# EAGLE design SolarSimulatorPanel (EAGLE 9.3.0)
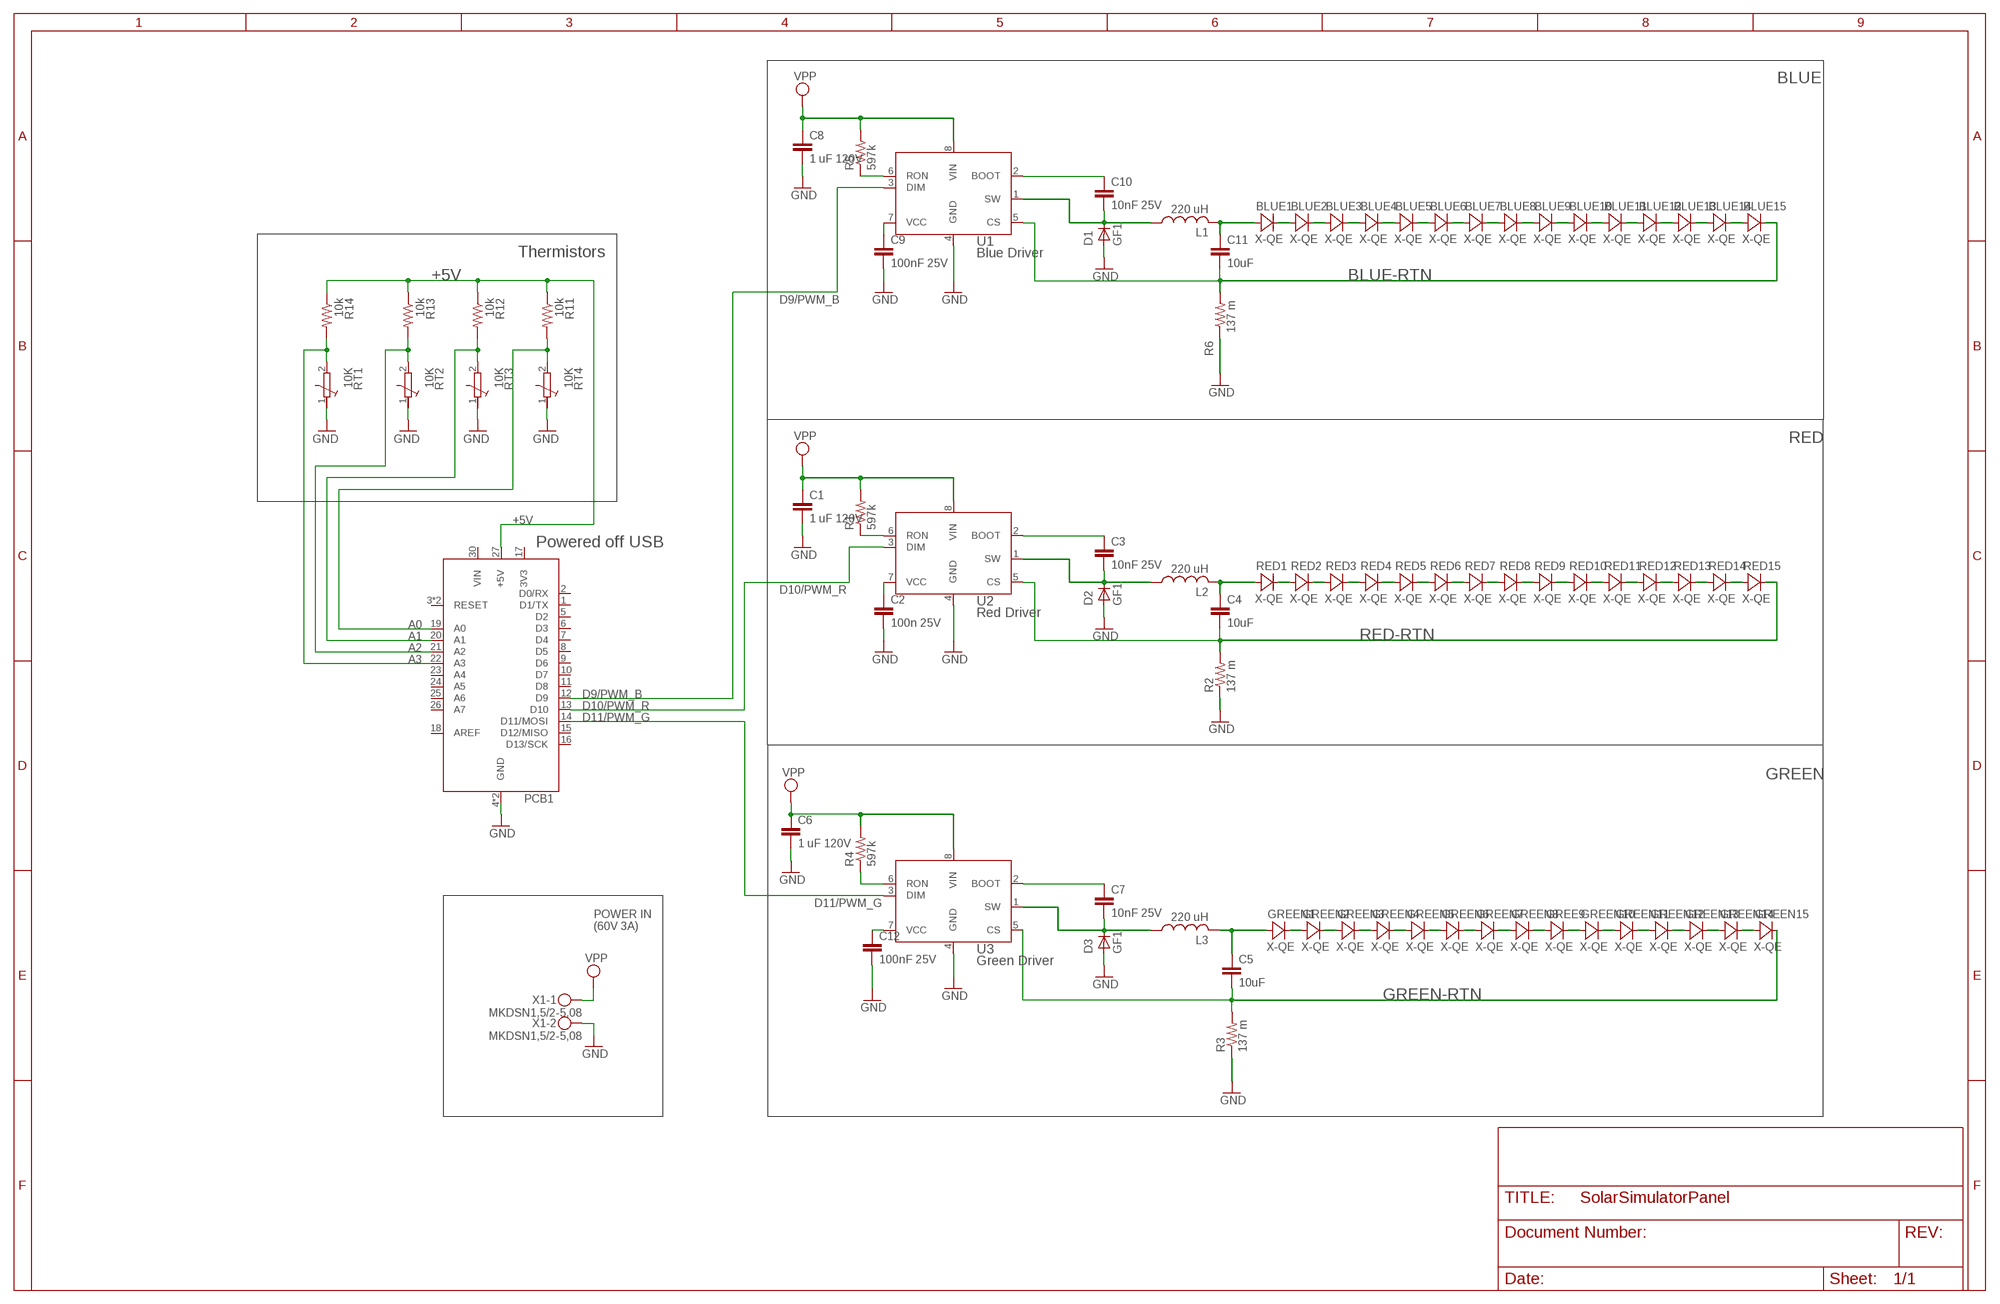
[diagram p0: schematic, sheet 1]

## Parts
BLUE1  X-QE  [X-QE]
BLUE2  X-QE  [X-QE]
BLUE3  X-QE  [X-QE]
BLUE4  X-QE  [X-QE]
BLUE5  X-QE  [X-QE]
BLUE6  X-QE  [X-QE]
BLUE7  X-QE  [X-QE]
BLUE8  X-QE  [X-QE]
BLUE9  X-QE  [X-QE]
BLUE10  X-QE  [X-QE]
BLUE11  X-QE  [X-QE]
BLUE12  X-QE  [X-QE]
BLUE13  X-QE  [X-QE]
BLUE14  X-QE  [X-QE]
BLUE15  X-QE  [X-QE]
C1  1 uF 120V  C-EUC2220K  [C2220K]
C2  100n 25V  C-EU0603-B-NOSILK  [.0603-B-NOSILK]
C3  10nF 25V  C-EU0603-B-NOSILK  [.0603-B-NOSILK]
C4  10uF  C-EU1206-B  [1206-B]
C5  10uF  C-EU1206-B  [1206-B]
C6  1 uF 120V  C-EUC2220K  [C2220K]
C7  10nF 25V  C-EU0603-B-NOSILK  [.0603-B-NOSILK]
C8  1 uF 120V  C-EUC2220K  [C2220K]
C9  100nF 25V  C-EU0603-B-NOSILK  [.0603-B-NOSILK]
C10  10nF 25V  C-EU0603-B-NOSILK  [.0603-B-NOSILK]
C11  10uF  C-EU1206-B  [1206-B]
C12  100nF 25V  C-EU0603-B-NOSILK  [.0603-B-NOSILK]
D1  GF1  [SMA-DO214AC]
D2  GF1  [SMA-DO214AC]
D3  GF1  [SMA-DO214AC]
GREE9  X-QE  [X-QE]
GREEN1  X-QE  [X-QE]
GREEN2  X-QE  [X-QE]
GREEN3  X-QE  [X-QE]
GREEN4  X-QE  [X-QE]
GREEN5  X-QE  [X-QE]
GREEN6  X-QE  [X-QE]
GREEN7  X-QE  [X-QE]
GREEN8  X-QE  [X-QE]
GREEN10  X-QE  [X-QE]
GREEN11  X-QE  [X-QE]
GREEN12  X-QE  [X-QE]
GREEN13  X-QE  [X-QE]
GREEN14  X-QE  [X-QE]
GREEN15  X-QE  [X-QE]
L1  220 uH  FILTERINDUCTOR  [P1170]
L2  220 uH  FILTERINDUCTOR  [P1170]
L3  220 uH  FILTERINDUCTOR  [P1170]
PCB1  ARDUINO_NANO  [ARDUINO_NANO_SHIELD]
R1  597k  R-US_0603-B-NOSILK  [.0603-B-NOSILK]
R2  137 m  R-US_R2010  [R2010]
R3  137 m  R-US_R2010  [R2010]
R4  597k  R-US_0603-B-NOSILK  [.0603-B-NOSILK]
R5  597k  R-US_0603-B-NOSILK  [.0603-B-NOSILK]
R6  137 m  R-US_R2010  [R2010]
R11  10k  R-US_0603-B-NOSILK  [.0603-B-NOSILK]
R12  10k  R-US_0603-B-NOSILK  [.0603-B-NOSILK]
R13  10k  R-US_0603-B-NOSILK  [.0603-B-NOSILK]
R14  10k  R-US_0603-B-NOSILK  [.0603-B-NOSILK]
RED1  X-QE  [X-QE]
RED2  X-QE  [X-QE]
RED3  X-QE  [X-QE]
RED4  X-QE  [X-QE]
RED5  X-QE  [X-QE]
RED6  X-QE  [X-QE]
RED7  X-QE  [X-QE]
RED8  X-QE  [X-QE]
RED9  X-QE  [X-QE]
RED10  X-QE  [X-QE]
RED11  X-QE  [X-QE]
RED12  X-QE  [X-QE]
RED13  X-QE  [X-QE]
RED14  X-QE  [X-QE]
RED15  X-QE  [X-QE]
RT1  10K  NTCTHERMISTER  [R0402]
RT2  10K  NTCTHERMISTER  [R0402]
RT3  10K  NTCTHERMISTER  [R0402]
RT4  10K  NTCTHERMISTER  [R0402]
U1  Blue Driver  LM3404HVMA  [M08A]
U2  Red Driver  LM3404HVMA  [M08A]
U3  Green Driver  LM3404HVMA  [M08A]
X1  MKDSN1,5/2-5,08  [MKDSN1,5/2-5,08]

## Nets
88: RED5.CATHODE(C) RED6.ANODE(A)
+5V: PCB1.27(+5V) R11.1 R12.1 R13.1 R14.1
A0: PCB1.19(A0) R11.2 RT4.2(E)
A1: PCB1.20(A1) R12.2 RT3.2(E)
A2: PCB1.21(A2) R13.2 RT2.2(E)
A3: PCB1.22(A3) R14.2 RT1.2(E)
BLUE-OUT: BLUE1.ANODE(A) C11.1 L1.P$2
BLUE-RTN: BLUE15.CATHODE(C) C11.2 R6.2 U1.5(CS)
D9/PWM_B: PCB1.12(D9) U1.3(DIM)
D10/PWM_R: PCB1.13(D10) U2.3(DIM)
D11/PWM_G: PCB1.14(D11/MOSI) U3.3(DIM)
GND: C1.2 C2.2 C6.2 C8.2 C9.2 C12.2 D1.A D2.A D3.A PCB1.4(GND) PCB1.29(GND) R2.1 R3.1 R6.1 RT1.1(A) RT2.1(A) RT3.1(A) RT4.1(A) U1.4(GND) U2.4(GND) U3.4(GND) X1.2
GREEN-RTN: C5.2 GREEN15.CATHODE(C) R3.2 U3.5(CS)
GRN-OUT: C5.1 GREEN1.ANODE(A) L3.P$2
N$1: C7.2 D3.K(C) L3.P$1 U3.1(SW)
N$2: GREEN10.CATHODE(C) GREEN11.ANODE(A)
N$4: C2.1 U2.7(VCC)
N$5: RED6.CATHODE(C) RED7.ANODE(A)
N$6: R1.1 U2.6(RON)
N$7: RED7.CATHODE(C) RED8.ANODE(A)
N$8: RED8.CATHODE(C) RED9.ANODE(A)
N$8SHSHOW: BLUE9.CATHODE(C) BLUE10.ANODE(A)
N$9: RED9.CATHODE(C) RED10.ANODE(A)
N$10: RED11.CATHODE(C) RED12.ANODE(A)
N$11: RED12.CATHODE(C) RED13.ANODE(A)
N$12: RED13.CATHODE(C) RED14.ANODE(A)
N$13: RED14.CATHODE(C) RED15.ANODE(A)
N$14: RED1.CATHODE(C) RED2.ANODE(A)
N$15: RED2.CATHODE(C) RED3.ANODE(A)
N$16: RED3.CATHODE(C) RED4.ANODE(A)
N$17: RED4.CATHODE(C) RED5.ANODE(A)
N$18: R5.1 U1.6(RON)
N$19: R4.1 U3.6(RON)
N$20: BLUE6.CATHODE(C) BLUE7.ANODE(A)
N$21: BLUE7.CATHODE(C) BLUE8.ANODE(A)
N$22: C3.1 U2.2(BOOT)
N$23: BLUE8.CATHODE(C) BLUE9.ANODE(A)
N$25: C3.2 D2.K(C) L2.P$1 U2.1(SW)
N$26: BLUE11.CATHODE(C) BLUE12.ANODE(A)
N$27: BLUE12.CATHODE(C) BLUE13.ANODE(A)
N$29: BLUE13.CATHODE(C) BLUE14.ANODE(A)
N$30: BLUE14.CATHODE(C) BLUE15.ANODE(A)
N$31: BLUE1.CATHODE(C) BLUE2.ANODE(A)
N$32: C7.1 U3.2(BOOT)
N$33: C12.1 U3.7(VCC)
N$34: C10.2 D1.K(C) L1.P$1 U1.1(SW)
N$35: GREEN1.CATHODE(C) GREEN2.ANODE(A)
N$36: GREEN2.CATHODE(C) GREEN3.ANODE(A)
N$37: GREEN3.CATHODE(C) GREEN4.ANODE(A)
N$38: GREEN4.CATHODE(C) GREEN5.ANODE(A)
N$39: GREEN6.CATHODE(C) GREEN7.ANODE(A)
N$40: GREEN7.CATHODE(C) GREEN8.ANODE(A)
N$41: GREE9.ANODE(A) GREEN8.CATHODE(C)
N$42: GREE9.CATHODE(C) GREEN10.ANODE(A)
N$43: GREEN11.CATHODE(C) GREEN12.ANODE(A)
N$44: GREEN12.CATHODE(C) GREEN13.ANODE(A)
N$45: GREEN13.CATHODE(C) GREEN14.ANODE(A)
N$46: GREEN14.CATHODE(C) GREEN15.ANODE(A)
N$48: BLUE2.CATHODE(C) BLUE3.ANODE(A)
N$49: BLUE3.CATHODE(C) BLUE4.ANODE(A)
N$50: BLUE4.CATHODE(C) BLUE5.ANODE(A)
N$52: C10.1 U1.2(BOOT)
N$53: C9.1 U1.7(VCC)
N$56: BLUE5.CATHODE(C) BLUE6.ANODE(A)
N$57: BLUE10.CATHODE(C) BLUE11.ANODE(A)
N$77: GREEN5.CATHODE(C) GREEN6.ANODE(A)
N$88: RED10.CATHODE(C) RED11.ANODE(A)
RED-OUT: C4.1 L2.P$2 RED1.ANODE(A)
RED-RTN: C4.2 R2.2 RED15.CATHODE(C) U2.5(CS)
VPP: C1.1 C6.1 C8.1 R1.2 R4.2 R5.2 U1.8(VIN) U2.8(VIN) U3.8(VIN) X1.1
Unconnected: PCB1.1(D1/TX) PCB1.2(D0/RX) PCB1.3(RESET) PCB1.5(D2) PCB1.6(D3) PCB1.7(D4) PCB1.8(D5) PCB1.9(D6) PCB1.10(D7) PCB1.11(D8) PCB1.15(D12/MISO) PCB1.16(D13/SCK) PCB1.23(A4) PCB1.24(A5) PCB1.25(A6) PCB1.26(A7) PCB1.28(RESET)

## Notes on the sheet
- BLUE
- Thermistors
- RED
- Powered off USB
- GREEN
- POWER IN
  (60V 3A)

## Power pins joined to a net without a drawn wire
3V3: PCB1.17(3V3)
AREF: PCB1.18(AREF)
VIN: PCB1.30(VIN)

## Library data of the parts
BLUE1-BLUE15 GREE9 GREEN1-GREEN8 GREEN10-GREEN15 RED1-RED15 = solarsim:X-QE
C1 C6 C8 = rcl:C-EU: CAPACITOR, European symbol; SPICEPREFIX: C
C2-C5 C7 C9-C12 = oresat-rcl:C-EU: CAPACITOR, European symbol
D1-D3 = diode:GF1: DIODE
L1-L3 = solarsim:FILTERINDUCTOR; MFR: Bourns; MPN: SRR1260-221K
PCB1 = solarsim:ARDUINO_NANO: Arduino Nano, Through Hole and SMT.
R1 R4 R5 R11-R14 = oresat-rcl:R-US_: RESISTOR, American symbol
R2 R3 R6 = rcl:R-US_: RESISTOR, American symbol; SPICEPREFIX: R
RT1-RT4 = solarsim:NTCTHERMISTER
U1-U3 = solarsim:LM3404HVMA; MANUFACTURER_PART_NUMBER: lm3404hvma; VENDOR: Texas Instruments
X1 = con-phoenix-508:MKDSN1,5/2-5,08: MKDSN 1,5/ 2-5,08 Printklemme Nennstrom: 13,5 A Nennspannung: 250 V Rastermaß: 5,08 mm Polzahl: 2 Anschlussart: Schraubanschluss Montage: Löten Anschlussrichtung Leiter/Platine: 0 ° Artikelnummer: 1729128 Source: http://eshop.phoenixcontact.com .. 1729128.pdf

## Board
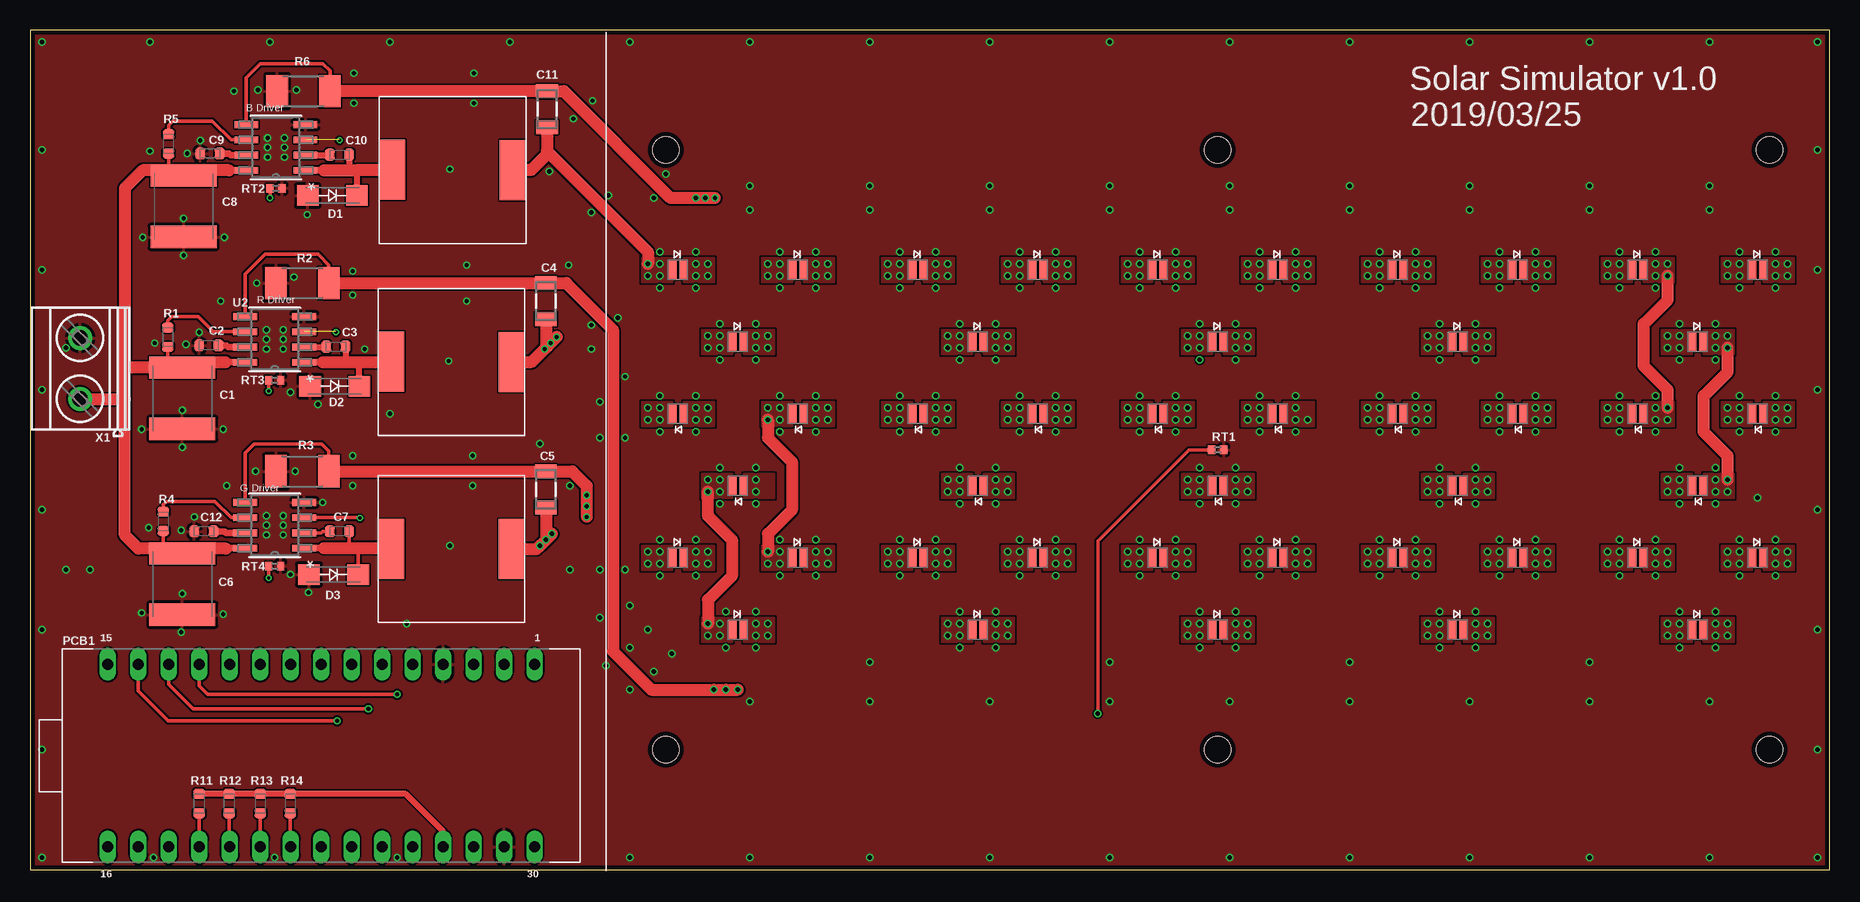
[diagram p1: board, top side]
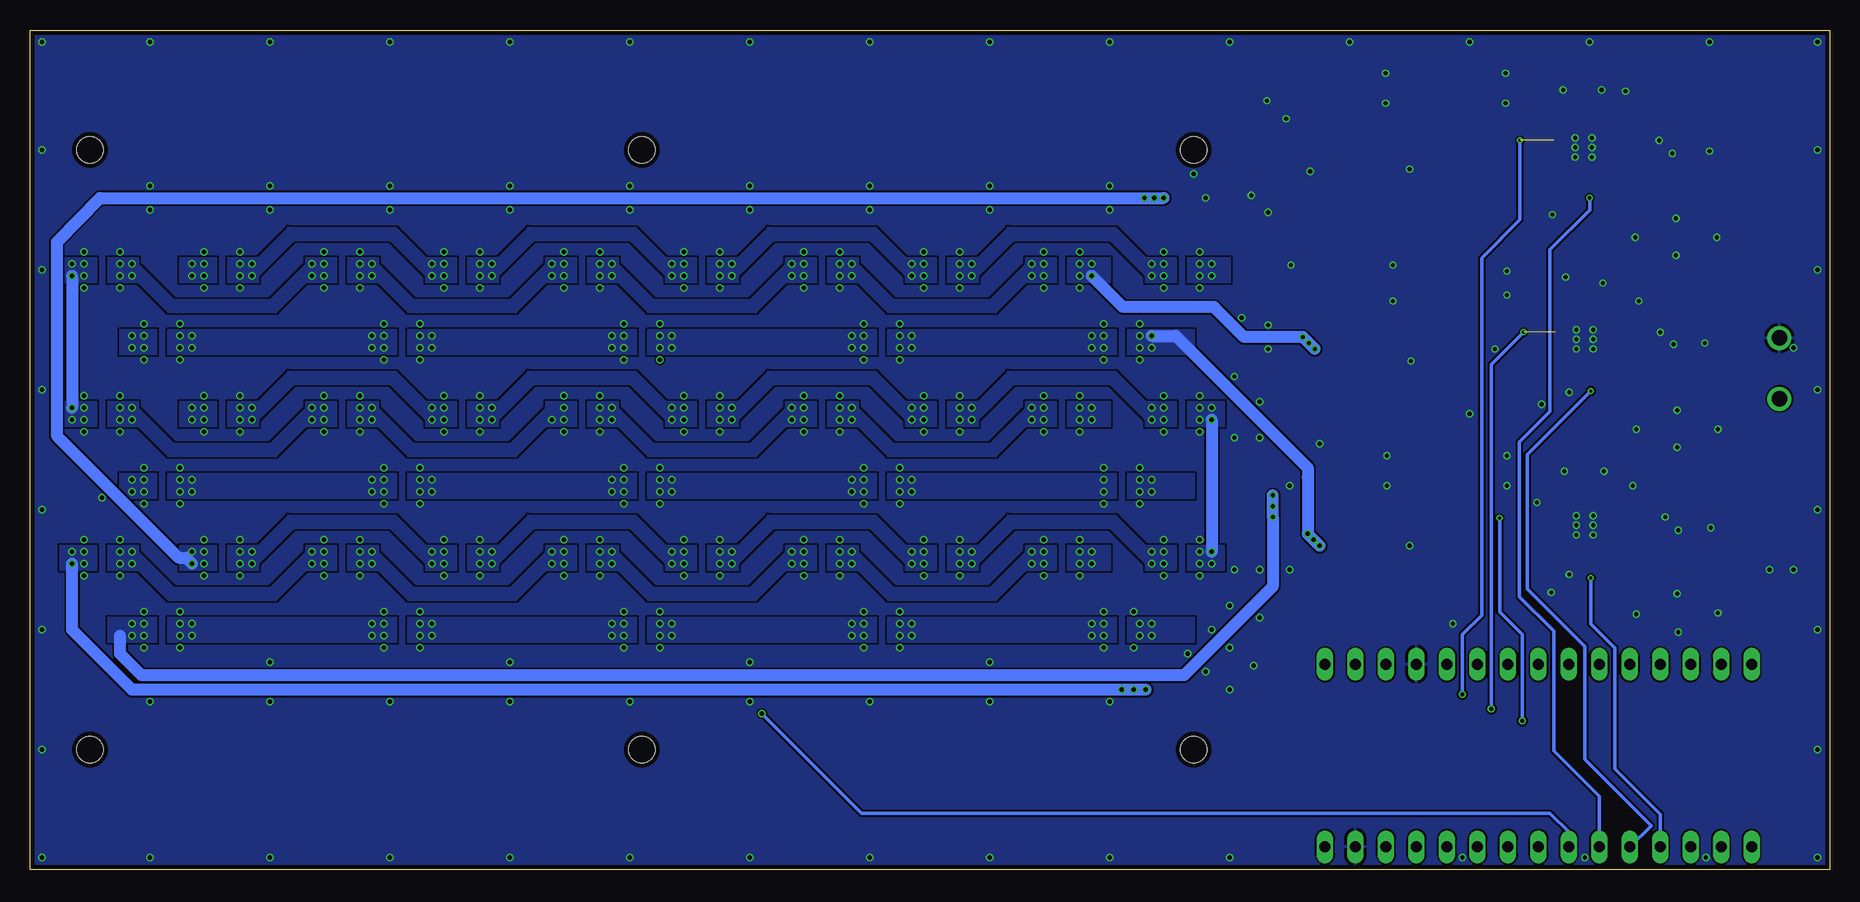
[diagram p2: board, bottom side, seen from below]

Size 150 x 70 mm. Coordinates in mm from the lower left corner, seen from the top.
Outline: 0,0 150,0 150,70 0,70 0,0
Copper layers (1*16): Top 0.035559375mm / dielectric 1.6mm / Bottom 0.035559375mm
Design rules "oshpark-2layer": minimum track width 6mil, minimum drill 10mil, track to track 6mil, track to pad 6mil, pad to pad 6mil, via to via 6mil, smd to smd 6mil, copper to edge 15mil, drill to drill 6mil, minimum pad ring 5mil, minimum via ring 5mil, stop-mask expansion 2.5mil, vias tented up to drill 0mil, thermal gap 10mil
Holes 2.2 mm at 145,60 145,10 53,10 53,60 99,60 99,10

### Footprints (pad centres in the part's own frame; a part is rotated, then mirrored left to right if it is on the bottom)
X-QE = smd 0.65 x 1.6: ANODE -0.45,0; CATHODE 0.45,0
C2220K = smd 1.85 x 5.5: 1 -2.55,0; 2 2.55,0
.0603-B-NOSILK = smd 0.8 x 0.95: 1 -0.8,0; 2 0.8,0
1206-B = smd 1.15 x 1.8: 1 -1.5,0; 2 1.5,0
SMA-DO214AC = smd 1.8 x 1.7: A -2.05,0; K 2.05,0
P1170 = smd 2.12 x 5: P$1 1.13,6.14; P$2 11.11,6.12
ARDUINO_NANO_SHIELD = drill 0.914 long: 1 19.05,7.62; 2 16.51,7.62; 3 13.97,7.62; 4 11.43,7.62; 5 8.89,7.62; 6 6.35,7.62; 7 3.81,7.62; 8 1.27,7.62; 9 -1.27,7.62; 10 -3.81,7.62; 11 -6.35,7.62; 12 -8.89,7.62; 13 -11.43,7.62; 14 -13.97,7.62; 15 -16.51,7.62; 16 -16.51,-7.62; 17 -13.97,-7.62; 18 -11.43,-7.62; 19 -8.89,-7.62; 20 -6.35,-7.62; 21 -3.81,-7.62; 22 -1.27,-7.62; 23 1.27,-7.62; 24 3.81,-7.62; 25 6.35,-7.62; 26 8.89,-7.62; 27 11.43,-7.62; 28 13.97,-7.62; 29 16.51,-7.62; 30 19.05,-7.62
R2010 = smd 1.8 x 2.7: 1 -2.2,0; 2 2.2,0
R0402 = smd 0.6 x 0.7: 1 -0.5,0; 2 0.5,0
M08A = smd 1.981 x 0.559: 1 -2.464,1.905; 2 -2.464,0.635; 3 -2.464,-0.635; 4 -2.464,-1.905; 5 2.464,-1.905; 6 2.464,-0.635; 7 2.464,0.635; 8 2.464,1.905
MKDSN1,5/2-5,08 = drill 1.3 pad 2: 1 -2.561,0.025; 2 2.519,0.025

### Placement (x,y rotation side)
BLUE1  54,50 0 top
BLUE2  74,50 0 top
BLUE3  94,50 0 top
BLUE4  114,50 0 top
BLUE5  134,50 0 top
BLUE6  134,38 180 top
BLUE7  114,38 180 top
BLUE8  94,38 180 top
BLUE9  74,38 180 top
BLUE10  54,38 180 top
BLUE11  54,26 0 top
BLUE12  74,26 0 top
BLUE13  94,26 0 top
BLUE14  114,26 0 top
BLUE15  134,26 0 top
C1  12.7,39.3 270 top
C2  14.9,43.7 180 top
C3  25.5,43.6 0 top
C4  43,47.4 90 top
C5  43,31.7 90 top
C6  12.7,23.8 270 top
C7  25.8,28.2 0 top
C8  12.8,55.3 270 top
C9  15,59.7 180 top
C10  25.8,59.6 0 top
C11  43.1,63.4 90 top
C12  14.5,28.2 180 top
D1  25.2,56.2 0 top
D2  25.4,40.3 0 top
D3  25.3,24.6 0 top
GREE9  79,32 180 top
GREEN1  59,44 0 top
GREEN2  79,44 0 top
GREEN3  99,44 0 top
GREEN4  119,44 0 top
GREEN5  139,44 0 top
GREEN6  139,32 180 top
GREEN7  119,32 180 top
GREEN8  99,32 180 top
GREEN10  59,32 180 top
GREEN11  59,20 0 top
GREEN12  79,20 0 top
GREEN13  99,20 0 top
GREEN14  119,20 0 top
GREEN15  139,20 0 top
L1  29.1,52.2 0 top
L2  29,36.2 0 top
L3  29,20.6 0 top
PCB1  23,9.5 0 top
R1  11.49,44.39 270 top
R2  22.7,48.9 0 top
R3  22.7,33.2 0 top
R4  11.12,29.03 270 top
R5  11.55,60.5 270 top
R6  22.8,64.9 0 top
R11  14.1,5.5 270 top
R12  16.6,5.5 270 top
R13  19.2,5.5 270 top
R14  21.7,5.5 270 top
RED1  64,50 0 top
RED2  84,50 0 top
RED3  104,50 0 top
RED4  124,50 0 top
RED5  144,50 0 top
RED6  144,38 180 top
RED7  124,38 180 top
RED8  104,38 180 top
RED9  84,38 180 top
RED10  64,38 180 top
RED11  64,26 0 top
RED12  84,26 0 top
RED13  104,26 0 top
RED14  124,26 0 top
RED15  144,26 0 top
RT1  99,35 180 top
RT2  20.5,56.8 180 top
RT3  20.4,40.8 180 top
RT4  20.4,25.3 180 top
U1  20.5,60.2 180 top
U2  20.4,44.2 180 top
U3  20.4,28.7 180 top
X1  4.2,41.8 90 top

### Tracks (layer width: path | path; a pad name or v marks a point on that pad's centre or on a via)
88  (via drill 0.35)
  Bottom 1: v146.5,49.5 v146.5,38.5
  other vias: 145.5,50.5 145.5,49.5 145.5,37.5 145.5,38.5 146.5,37.5 146.5,50.5
  pour Top (no thermals): 144.5,39 147,39 147,37 144.5,37
  pour Bottom (no thermals): 144.5,39 147.5,39 147.5,37 144.5,37
  pour Bottom (no thermals): 144.5,51 147.5,51 147.5,49 144.5,49
  pour Top (no thermals): 144.5,51 147,51 147,49 144.5,49
+5V
  Top 0.5: PCB1.27 34.43,3.17 31.3,6.3 R14.1 R13.1 R12.1 R11.1
A0  (via drill 0.25)
  Top 0.3: RT4.2 v19.9,24.3 | R11.2 PCB1.19
  Bottom 0.3: v19.9,24.3 19.9,20.5 17.9,18.5 17.9,8.4 14.1,4.6 PCB1.19
A1  (via drill 0.25)
  Top 0.3: RT3.2 v19.9,39.9 | R12.2 16.6,1.93 PCB1.20
  Bottom 0.3: v19.9,39.9 25.2,34.6 25.2,23.4 20.4,18.6 20.4,9.2 14.87,3.67 PCB1.20
A2  (via drill 0.25)
  Top 0.3: RT2.2 v20,56 | R13.2 PCB1.21
  Bottom 0.3: v20,56 20,55 23.3,51.7 23.3,38.2 25.85,35.65 25.85,22.75 23,19.9 23,9.9 19.19,6.09 PCB1.21
A3  (via drill 0.35)
  Top 0.3: RT1.2 96.6,35 89,27.4 v89,13 | R14.2 21.7,1.91 PCB1.22
  Bottom 0.3: v89,13 80.7,4.7 23.3,4.7 21.7,3.1 21.7,1.91 PCB1.22
BLUE-OUT  (via drill 0.35)
  Top 1: L1.P$2 41.78,58.32 43.1,59.64 C11.1 43.1,59.9 51.5,51.5 v51.5,50.5
  other vias: 52.5,49.5 52.5,50.5 51.5,49.5
  pour Top (no thermals): 51,51 53.5,51 53.5,49 51,49
  pour Bottom (no thermals): 53.5,49 53.5,51 50,51 50,49
BLUE-RTN  (via drill 0.35)
  Top 0.3: U1.5 18.04,66.04 19.2,67.2 24.4,67.2 25,66.6 R6.2
  Top 1: R6.2 C11.2 44.5,64.9 53.4,56 v55.5,56 v56.3,56 v57.1,56
  Bottom 1: v55.5,56 144.18,56 147.76,52.32 147.76,36.16 137.6,26 137,26 v136.5,25.5
  other vias: 136.5,26.5 135.5,26.5 135.5,25.5
  pour Top (no thermals): 134.5,27 137,27 137,25 134.5,25
  pour Bottom (no thermals): 134.5,27 137.5,27 137.5,25 134.5,25
D9/PWM_B  (via drill 0.25, 0.35)  (1 unrouted)
  Top 0.3: 25.77,60.84 v25.8,60.8 | v30.6,14.6 14.8,14.6 14.1,15.3 14.11,15.31 PCB1.12
  Bottom 0.3: v25.8,60.8 25.8,54.2 29,51 29,21.2 30.6,19.6 v30.6,14.6
D10/PWM_R  (via drill 0.25, 0.35)  (1 unrouted)
  Top 0.3: 25.46,44.84 v25.5,44.8 | PCB1.13 11.57,15.43 13.6,13.4 v28.2,13.4
  Bottom 0.3: v25.5,44.8 28.2,42.1 v28.2,13.4
D11/PWM_G  (via drill 0.25, 0.35)
  Top 0.254: 27.46,29.34 v27.5,29.3
  Top 0.3: U3.3 27.46,29.34 | PCB1.14 9.03,14.93 9,14.9 11.5,12.4 v25.6,12.4
  Bottom 0.3: v27.5,29.3 27.5,21.5 25.6,19.6 v25.6,12.4
GND  (via drill 0.35)
  other vias: 55.5,48.5 52.5,48.5 52.5,51.5 55.5,51.5 75.5,48.5 72.5,48.5 72.5,51.5 75.5,51.5 95.5,48.5 92.5,48.5 92.5,51.5 95.5,51.5 115.5,48.5 112.5,48.5 112.5,51.5 115.5,51.5 135.5,48.5 132.5,48.5 132.5,51.5 135.5,51.5 135.5,36.5 132.5,36.5 132.5,39.5 135.5,39.5 115.5,36.5 112.5,36.5 112.5,39.5 115.5,39.5 120.5,42.5 117.5,42.5 117.5,45.5 120.5,45.5 100.5,42.5 97.5,45.5 100.5,45.5 80.5,42.5 77.5,42.5 77.5,45.5 80.5,45.5 60.5,42.5 57.5,42.5 57.5,45.5 60.5,45.5 80.5,30.5 77.5,30.5 77.5,33.5 80.5,33.5 100.5,30.5 97.5,30.5 97.5,33.5 100.5,33.5 120.5,30.5 117.5,30.5 117.5,33.5 120.5,33.5 95.5,24.5 92.5,24.5 92.5,27.5 95.5,27.5 75.5,24.5 72.5,24.5 72.5,27.5 75.5,27.5 115.5,24.5 112.5,24.5 112.5,27.5 115.5,27.5 135.5,24.5 132.5,27.5 135.5,27.5 100.5,18.5 97.5,18.5 97.5,21.5 100.5,21.5 120.5,18.5 117.5,18.5 117.5,21.5 120.5,21.5 80.5,18.5 77.5,18.5 77.5,21.5 80.5,21.5 60.5,18.5 58,18.5 58,21.5 60.5,21.5 60.5,30.5 57.5,30.5 57.5,33.5 60.5,33.5 137.5,18.5 140.5,21.5 137.5,21.5 75.5,36.5 72.5,36.5 72.5,39.5 75.5,39.5 95.5,36.5 92.5,36.5 92.5,39.5 95.5,39.5 19.7,27.9 19.7,28.7 19.7,29.5 21.1,29.5 21.1,28.7 21.1,27.9 21.1,43.4 21.1,44.2 21.1,45 19.7,45 19.7,44.2 19.7,43.4 19.8,60.2 19.8,61 21.2,61 21.2,60.2 19.8,59.4 65.5,48.5 62.5,48.5 62.5,51.5 65.5,51.5 85.5,48.5 82.5,48.5 82.5,51.5 85.5,51.5 105.5,48.5 102.5,48.5 102.5,51.5 105.5,51.5 125.5,48.5 122.5,48.5 122.5,51.5 125.5,51.5 125.5,36.5 122.5,36.5 122.5,39.5 125.5,39.5 105.5,36.5 102.5,36.5 102.5,39.5 105.5,39.5 65.5,36.5 62.5,36.5 62.5,39.5 65.5,39.5 85.5,36.5 82.5,36.5 82.5,39.5 85.5,39.5 12.6,28.3 24.4,30.6 13,43.8 14.1,44.8 12.7,35.2 16.1,36.7 9.3,36.7 12.7,38.3 12.7,23 16.1,21.3 12.6,19.8 9.3,21.4 13.7,29.4 22.1,33.2 18.8,33.2 23.2,23.1 21.7,24.6 13.1,59.7 14.2,60.8 21.2,59.4 12.8,51.2 12.8,54.3 16.2,52.7 9.4,52.7 18.9,48.9 19,65 22.2,65 1,1 10.3,1 20.4,1 30.6,1 50,1 60,1 70,1 80,1 90,1 100,1 110,1 130,1 140,1 1,10 1,20 1,30 1,40 1,50 1,60 1,69 10,69 20,69 30,69 40,69 50,69 60,69 70,69 80,69 90,69 100,69 110,69 120,69 130,69 140,69 140.5,18.5 132.5,24.5 142.5,24.5 145.5,24.5 145.5,27.5 142.5,27.5 125.5,24.5 125.5,27.5 122.5,27.5 122.5,24.5 102.5,27.5 102.5,24.5 105.5,24.5 105.5,27.5 82.5,27.5 85.5,27.5 85.5,24.5 82.5,24.5 65.5,27.5 62.5,27.5 62.5,24.5 65.5,24.5 55.5,27.5 55.5,24.5 52.5,27.5 52.5,24.5 140.5,33.5 137.5,33.5 137.5,30.5 140.5,30.5 140.5,42.5 140.5,45.5 137.5,42.5 137.5,45.5 145.5,39.5 142.5,39.5 142.5,36.5 145.5,36.5 55.5,36.5 55.5,39.5 52.5,39.5 52.5,36.5 142.5,48.5 142.5,51.5 145.5,51.5 145.5,48.5 23.1,54.6 26.9,49.9 26.9,47.9 27.9,43.4 21.7,39.8 26.9,34.5 26.9,32 31.4,20.5 30,38 24,38.8 22,49.4 3,43.5 5,25 3,25 36.9,34.5 36.9,32 36.4,50.4 36.4,47.4 37,63.9 37,66.4 35,58.4 34.9,42.4 35,27 46.8,43.4 43.3,58.2 45.3,62.6 46.9,64.1 27,63.9 27,66.4 17,64.9 10,59.9 10.4,43.9 9.9,28.5 16.4,32 15.9,47.4 44.9,50.4 50,15 42.5,35.5 52,56 80,55 90,55 130,55 130,57 100,57 90,57 60,57 140,57 140,55 144,31 140,14 120,14 100,14 80,14 60,14 149,1 149,10 149,20 149,30 149,40 149,50 149,60 149,69 120,1 130,14 110,14 90,14 70,14 50,18.5 52,16.5 51.5,20 53.5,18 48,17 120,57 110,57 80,57 70,57 120,55 110,55 100,55 70,55 60,55 53,58 130,17.3 110,17.3 90,17.3 70,17.3 47.5,25 47.5,36 45,25 45,32 47.5,21 50,22 49.6,25 49.6,36 49.6,41.1 49,46 46.8,45.4 47.5,39 46.8,54.8 48.2,56.2
  pour Top (rank 6): 0,70 0,0 150,0 150,70
  pour Bottom (rank 6): 0,70 0,0 150,0 150,70
GND1  (via drill 0.35)
  other vias: 97.5,42.5
GREEN-RTN  (via drill 0.35)
  Top 0.3: U3.5 17.94,34.74 18.7,35.5 24.3,35.5 24.9,34.9 R3.2
  Top 1: R3.2 C5.2 45.2,33.2 46.4,32 v46.4,31.2 v46.4,30.3 v46.4,29.4
  Bottom 1: 142.5,19.5 142.5,18 140.7,16.2 53.8,16.2 46.4,23.6 v46.4,29.4 v46.4,30.3 v46.4,31.2
  other vias: 140.5,20.5 141.5,20.5 140.5,19.5 141.5,19.5
  pour Bottom (no thermals): 139.5,21 143.5,21 143.5,19 139.5,19
  pour Top (no thermals): 139.5,21 142,21 142,19 139.5,19
GRN-OUT  (via drill 0.35)
  Top 1: L3.P$2 42.22,26.72 v42.5,27 v43,27.5 | v43,27.5 v43.5,28 | C5.1 v43,27.5
  Bottom 1: v56.5,44.5 54.5,44.5 43.5,33.5 43.5,32.7 v43.5,28 v42.5,27
  other vias: 57.5,44.5 57.5,43.5 56.5,43.5
  pour Top (no thermals): 56,45 58.5,45 58.5,43 56,43
  pour Bottom (no thermals): 58.5,43 58.5,45 53,45 53,43
N$1
  Top 0.3: C7.2 26.6,26.8 | D3.K 27.35,26.75 27.3,26.8
  Top 0.555: U3.1 24.5,26.8
  Top 1: 24.5,26.8 26.6,26.8 27.3,26.8 30.07,26.8 L3.P$1
N$2  (via drill 0.35)
  Top 1: v56.5,20.5 56.5,22.5 58.5,24.5 58.5,27.5 56.5,29.5 v56.5,31.5
  other vias: 57.5,20.5 57.5,19.5 57.5,31.5 56.5,19.5 57.5,32.5 56.5,32.5
  pour Top (no thermals): 58.5,19 58.5,21 56,21 56,19
  pour Bottom (no thermals): 58.5,19 58.5,21 53,21 53,19
  pour Bottom (no thermals): 58.5,31 58.5,33 53,33 53,31
  pour Top (no thermals): 56,33 58.5,33 58.5,31 56,31
N$4
  Top 0.55: U2.7 16.54,43.56 16.4,43.7 C2.1
N$5  (via drill 0.35)
  other vias: 142.5,38.5 142.5,37.5 125.5,38.5 125.5,37.5 141.5,37.5 141.5,38.5 126.5,37.5 126.5,38.5
  pour Bottom (no thermals): 143.5,39 143.5,37 141,37 138.5,34.5 129.5,34.48 129.5,34.5 127,37 124.5,37 124.5,39 127,39 127,38.5 130,35.5 138,35.5 141,38.5 141,39
  pour Top (no thermals): 141,39 143.5,39 143.5,37 141,37
  pour Top (no thermals): 124.5,39 127,39 127,37 124.5,37
N$6
  Top 0.3: U2.6 15.27,44.84 14,46.1 11.8,46.1 11.49,45.79 R1.1
N$7  (via drill 0.35)
  other vias: 122.5,38.5 122.5,37.5 105.5,37.5 105.5,38.5 121.5,37.5 121.5,38.5 106.5,37.5
  pour Top (no thermals): 121,39 123.5,39 123.5,37 121,37
  pour Bottom (no thermals): 123.5,39 123.5,37 121,37 118.5,34.5 109.5,34.48 109.5,34.5 107,37 104.5,37 104.5,39 107,39 107,38.5 110,35.5 118,35.5 121,38.5 121,39
  pour Top (no thermals): 104.5,39 107,39 107,37 104.5,37
N$8  (via drill 0.35)
  other vias: 102.5,37.5 102.5,38.5 85.5,37.5 85.5,38.5 101.5,38.5 101.5,37.5 86.5,37.5 86.5,38.5
  pour Top (no thermals): 101,39 103.5,39 103.5,37 101,37
  pour Bottom (no thermals): 103.5,39 103.5,37 101,37 98.5,34.5 89.5,34.48 89.5,34.5 87,37 84.5,37 84.5,39 87,39 87,38.5 90,35.5 98,35.5 101,38.5 101,39
  pour Top (no thermals): 84.5,39 87,39 87,37 84.5,37
N$8SHSHOW  (via drill 0.35)
  other vias: 72.5,37.5 72.5,38.5 55.5,37.5 55.5,38.5 71.5,38.5 71.5,37.5 56.5,37.5 56.5,38.5
  pour Top (no thermals): 71,39 73.5,39 73.5,37 71,37
  pour Bottom (no thermals): 54.5,37 54.5,39 57,39 59.5,41.5 68.5,41.52 68.5,41.5 71,39 73.5,39 73.5,37 71,37 71,37.5 68,40.5 60,40.5 57,37.5 57,37
  pour Top (no thermals): 54.5,39 57,39 57,37 54.5,37
N$9  (via drill 0.35)
  other vias: 82.5,38.5 82.5,37.5 65.5,38.5 65.5,37.5 81.5,38.5 81.5,37.5 66.5,37.5 66.5,38.5
  pour Top (no thermals): 81,39 83.5,39 83.5,37 81,37
  pour Bottom (no thermals): 83.5,39 83.5,37 81,37 78.5,34.5 69.5,34.48 69.5,34.5 67,37 64.5,37 64.5,39 67,39 67,38.5 70,35.5 78,35.5 81,38.5 81,39
  pour Top (no thermals): 64.5,39 67,39 67,37 64.5,37
N$10  (via drill 0.35)
  other vias: 82.5,25.5 65.5,26.5 66.5,25.5 82.5,26.5 81.5,26.5 81.5,25.5 65.5,25.5 66.5,26.5
  pour Bottom (no thermals): 83.5,27 83.5,25 81,25 78.5,22.5 69.5,22.48 69.5,22.5 67,25 64.5,25 64.5,27 67,27 67,26.5 70,23.5 78,23.5 81,26.5 81,27
  pour Top (no thermals): 81,27 83.5,27 83.5,25 81,25
  pour Top (no thermals): 64.5,27 67,27 67,25 64.5,25
N$11  (via drill 0.35)
  other vias: 85.5,25.5 102.5,25.5 102.5,26.5 101.5,26.5 101.5,25.5 85.5,26.5 86.5,26.5 86.5,25.5
  pour Bottom (no thermals): 103.5,27 103.5,25 101,25 98.5,22.5 89.5,22.48 89.5,22.5 87,25 84.5,25 84.5,27 87,27 87,26.5 90,23.5 98,23.5 101,26.5 101,27
  pour Top (no thermals): 101,27 103.5,27 103.5,25 101,25
  pour Top (no thermals): 84.5,27 87,27 87,25 84.5,25
N$12  (via drill 0.35)
  other vias: 122.5,25.5 121.5,25.5 105.5,25.5 122.5,26.5 121.5,26.5 105.5,26.5 106.5,26.5 106.5,25.5
  pour Bottom (no thermals): 123.5,27 123.5,25 121,25 118.5,22.5 109.5,22.48 109.5,22.5 107,25 104.5,25 104.5,27 107,27 107,26.5 110,23.5 118,23.5 121,26.5 121,27
  pour Top (no thermals): 121,27 123.5,27 123.5,25 121,25
  pour Top (no thermals): 104.5,27 107,27 107,25 104.5,25
N$13  (via drill 0.35)
  other vias: 142.5,25.5 125.5,25.5 142.5,26.5 141.5,26.5 141.5,25.5 125.5,26.5 126.5,26.5 126.5,25.5
  pour Top (no thermals): 141,27 143.5,27 143.5,25 141,25
  pour Top (no thermals): 124.5,27 127,27 127,25 124.5,25
  pour Bottom (no thermals): 143.5,27 143.5,25 141,25 138.5,22.5 129.5,22.48 129.5,22.5 127,25 124.5,25 124.5,27 127,27 127,26.5 130,23.5 138,23.5 141,26.5 141,27
N$14  (via drill 0.35)
  other vias: 65.5,50.5 82.5,49.5 65.5,49.5 82.5,50.5 66.5,49.5 66.5,50.5 81.5,50.5 81.5,49.5
  pour Top (no thermals): 81,51 83.5,51 83.5,49 81,49
  pour Bottom (no thermals): 83.5,51 83.5,49 81,49 78.5,46.5 69.5,46.48 69.5,46.5 67,49 64.5,49 64.5,51 67,51 67,50.5 70,47.5 78,47.5 81,50.5 81,51
  pour Top (no thermals): 64.5,51 67,51 67,49 64.5,49
N$15  (via drill 0.35)
  other vias: 102.5,50.5 85.5,49.5 102.5,49.5 85.5,50.5 86.5,50.5 86.5,49.5 101.5,49.5 101.5,50.5
  pour Top (no thermals): 101,51 103.5,51 103.5,49 101,49
  pour Bottom (no thermals): 103.5,51 103.5,49 101,49 98.5,46.5 89.5,46.48 89.5,46.5 87,49 84.5,49 84.5,51 87,51 87,50.5 90,47.5 98,47.5 101,50.5 101,51
  pour Top (no thermals): 84.5,51 87,51 87,49 84.5,49
N$16  (via drill 0.35)
  other vias: 122.5,50.5 105.5,49.5 122.5,49.5 105.5,50.5 106.5,50.5 106.5,49.5 121.5,49.5 121.5,50.5
  pour Top (no thermals): 121,51 123.5,51 123.5,49 121,49
  pour Bottom (no thermals): 123.5,51 123.5,49 121,49 118.5,46.5 109.5,46.48 109.5,46.5 107,49 104.5,49 104.5,51 107,51 107,50.5 110,47.5 118,47.5 121,50.5 121,51
  pour Top (no thermals): 104.5,51 107,51 107,49 104.5,49
N$17  (via drill 0.35)
  other vias: 142.5,50.5 125.5,50.5 142.5,49.5 125.5,49.5 126.5,49.5 126.5,50.5 141.5,50.5 141.5,49.5
  pour Top (no thermals): 141,51 143.5,51 143.5,49 141,49
  pour Bottom (no thermals): 143.5,51 143.5,49 141,49 138.5,46.5 129.5,46.48 129.5,46.5 127,49 124.5,49 124.5,51 127,51 127,50.5 130,47.5 138,47.5 141,50.5 141,51
  pour Top (no thermals): 124.5,51 127,51 127,49 124.5,49
N$18
  Top 0.3: R5.1 11.55,62.05 11.9,62.4 15.2,62.4 16.77,60.84 U1.6
N$19
  Top 0.3: U3.6 16.77,29.34 15.4,30.7 11.4,30.7 11.12,30.42 R4.1
N$20  (via drill 0.35)
  other vias: 131.5,38.5 132.5,38.5 115.5,37.5 115.5,38.5 132.5,37.5 131.5,37.5 116.5,38.5 116.5,37.5
  pour Top (no thermals): 131,39 133.5,39 133.5,37 131,37
  pour Bottom (no thermals): 114.5,37 114.5,39 117,39 119.5,41.5 128.5,41.52 128.5,41.5 131,39 133.5,39 133.5,37 131,37 131,37.5 128,40.5 120,40.5 117,37.5 117,37
  pour Top (no thermals): 114.5,39 117,39 117,37 114.5,37
N$21  (via drill 0.35)
  other vias: 112.5,37.5 112.5,38.5 95.5,37.5 95.5,38.5 111.5,38.5 111.5,37.5 96.5,38.5 96.5,37.5
  pour Top (no thermals): 111,39 113.5,39 113.5,37 111,37
  pour Bottom (no thermals): 94.5,37 94.5,39 97,39 99.5,41.5 108.5,41.52 108.5,41.5 111,39 113.5,39 113.5,37 111,37 111,37.5 108,40.5 100,40.5 97,37.5 97,37
  pour Top (no thermals): 94.5,39 97,39 97,37 94.5,37
N$22
  Top 0.5: U2.2 24.66,43.56 C3.1
N$23  (via drill 0.35)
  other vias: 92.5,37.5 92.5,38.5 75.5,37.5 75.5,38.5 91.5,38.5 91.5,37.5 76.5,37.5 76.5,38.5
  pour Top (no thermals): 91,39 93.5,39 93.5,37 91,37
  pour Bottom (no thermals): 74.5,37 74.5,39 77,39 79.5,41.5 88.5,41.52 88.5,41.5 91,39 93.5,39 93.5,37 91,37 91,37.5 88,40.5 80,40.5 77,37.5 77,37
  pour Top (no thermals): 74.5,39 77,39 77,37 74.5,37
N$25
  Top 0.5: C3.2 26.3,42.3 | D2.K 27.45,42.25 27.4,42.3
  Top 0.55: U2.1 24.4,42.3
  Top 1: 24.4,42.3 26.3,42.3 27.4,42.3 30.09,42.3 L2.P$1
N$26  (via drill 0.35)
  other vias: 55.5,26.5 71.5,26.5 72.5,26.5 72.5,25.5 71.5,25.5 55.5,25.5 56.5,25.5 56.5,26.5
  pour Bottom (no thermals): 54.5,25 54.5,27 57,27 59.5,29.5 68.5,29.52 68.5,29.5 71,27 73.5,27 73.5,25 71,25 71,25.5 68,28.5 60,28.5 57,25.5 57,25
  pour Top (no thermals): 71,27 73.5,27 73.5,25 71,25
  pour Top (no thermals): 54.5,27 57,27 57,25 54.5,25
N$27  (via drill 0.35)
  other vias: 75.5,26.5 91.5,26.5 92.5,25.5 92.5,26.5 91.5,25.5 76.5,26.5 75.5,25.5 76.5,25.5
  pour Bottom (no thermals): 74.5,25 74.5,27 77,27 79.5,29.5 88.5,29.52 88.5,29.5 91,27 93.5,27 93.5,25 91,25 91,25.5 88,28.5 80,28.5 77,25.5 77,25
  pour Top (no thermals): 91,27 93.5,27 93.5,25 91,25
  pour Top (no thermals): 74.5,27 77,27 77,25 74.5,25
N$29  (via drill 0.35)
  other vias: 95.5,26.5 112.5,26.5 112.5,25.5 111.5,25.5 111.5,26.5 95.5,25.5 96.5,25.5 96.5,26.5
  pour Bottom (no thermals): 94.5,25 94.5,27 97,27 99.5,29.5 108.5,29.52 108.5,29.5 111,27 113.5,27 113.5,25 111,25 111,25.5 108,28.5 100,28.5 97,25.5 97,25
  pour Top (no thermals): 111,27 113.5,27 113.5,25 111,25
  pour Top (no thermals): 94.5,27 97,27 97,25 94.5,25
N$30  (via drill 0.35)
  other vias: 115.5,26.5 132.5,26.5 131.5,26.5 132.5,25.5 131.5,25.5 115.5,25.5 116.5,26.5 116.5,25.5
  pour Top (no thermals): 131,27 133.5,27 133.5,25 131,25
  pour Top (no thermals): 114.5,27 117,27 117,25 114.5,25
  pour Bottom (no thermals): 114.5,25 114.5,27 117,27 119.5,29.5 128.5,29.52 128.5,29.5 131,27 133.5,27 133.5,25 131,25 131,25.5 128,28.5 120,28.5 117,25.5 117,25
N$31  (via drill 0.35)
  other vias: 55.5,50.5 72.5,49.5 72.5,50.5 55.5,49.5 56.5,49.5 56.5,50.5 71.5,49.5 71.5,50.5
  pour Top (no thermals): 71,51 73.5,51 73.5,49 71,49
  pour Bottom (no thermals): 54.5,49 54.5,51 57,51 59.5,53.5 68.5,53.52 68.5,53.5 71,51 73.5,51 73.5,49 71,49 71,49.5 68,52.5 60,52.5 57,49.5 57,49
  pour Top (no thermals): 54.5,51 57,51 57,49 54.5,49
N$32
  Top 0.3: U3.2 24.27,28.07 24.4,28.2 C7.1
N$33
  Top 0.55: U3.7 16.34,28.07 16.2,28.2 C12.1
N$34
  Top 0.5: C10.2 26.6,58.3 | D1.K 27.25,58.25 27.2,58.3 | L1.P$1 29.14,58.34 29.1,58.3
  Top 0.55: U1.1 24.5,58.3
  Top 1: 24.5,58.3 26.6,58.3 27.2,58.3 29.1,58.3
N$35  (via drill 0.35)
  other vias: 60.5,44.5 77.5,44.5 77.5,43.5 60.5,43.5 76.5,43.5 76.5,44.5 61.5,44.5 61.5,43.5
  pour Top (no thermals): 76,45 78.5,45 78.5,43 76,43
  pour Bottom (no thermals): 78.5,45 78.5,43 59.5,43 59.5,45
  pour Top (no thermals): 59.5,45 62,45 62,43 59.5,43
N$36  (via drill 0.35)
  other vias: 80.5,43.5 97.5,44.5 97.5,43.5 80.5,44.5 96.5,43.5 96.5,44.5 81.5,44.5 81.5,43.5
  pour Top (no thermals): 96,45 98.5,45 98.5,43 96,43
  pour Bottom (no thermals): 98.5,45 98.5,43 79.5,43 79.5,45
  pour Top (no thermals): 79.5,45 82,45 82,43 79.5,43
N$37  (via drill 0.35)
  other vias: 100.5,44.5 117.5,44.5 117.5,43.5 100.5,43.5 116.5,43.5 116.5,44.5 101.5,44.5 101.5,43.5
  pour Top (no thermals): 116,45 118.5,45 118.5,43 116,43
  pour Bottom (no thermals): 118.5,45 118.5,43 99.5,43 99.5,45
  pour Top (no thermals): 99.5,45 102,45 102,43 99.5,43
N$38  (via drill 0.35)
  other vias: 120.5,43.5 137.5,44.5 120.5,44.5 137.5,43.5 136.5,43.5 136.5,44.5 121.5,44.5 121.5,43.5
  pour Top (no thermals): 136,45 138.5,45 138.5,43 136,43
  pour Bottom (no thermals): 138.5,45 138.5,43 119.5,43 119.5,45
  pour Top (no thermals): 119.5,45 122,45 122,43 119.5,43
N$39  (via drill 0.35)
  other vias: 120.5,32.5 137.5,32.5 137.5,31.5 120.5,31.5 136.5,31.5 136.5,32.5 121.5,31.5 121.5,32.5
  pour Top (no thermals): 136,33 138.5,33 138.5,31 136,31
  pour Bottom (no thermals): 138.5,33 138.5,31 119.5,31 119.5,33
  pour Top (no thermals): 119.5,33 122,33 122,31 119.5,31
N$40  (via drill 0.35)
  other vias: 100.5,32.5 117.5,32.5 116.5,31.5 100.5,31.5 117.5,31.5 116.5,32.5 101.5,32.5 101.5,31.5
  pour Top (no thermals): 116,33 118.5,33 118.5,31 116,31
  pour Bottom (no thermals): 118.5,33 118.5,31 99.5,31 99.5,33
  pour Top (no thermals): 99.5,33 102,33 102,31 99.5,31
N$41  (via drill 0.35)
  other vias: 80.5,32.5 97.5,32.5 96.5,31.5 81.5,31.5 97.5,31.5 96.5,32.5 80.5,31.5 81.5,32.5
  pour Top (no thermals): 96,33 98.5,33 98.5,31 96,31
  pour Bottom (no thermals): 98.5,33 98.5,31 79.5,31 79.5,33
  pour Top (no thermals): 79.5,33 82,33 82,31 79.5,31
N$42  (via drill 0.35)
  other vias: 60.5,32.5 77.5,31.5 77.5,32.5 60.5,31.5 76.5,32.5 76.5,31.5
  pour Top (no thermals): 76,33 78.5,33 78.5,31 76,31
  pour Bottom (no thermals): 78.5,33 78.5,31 59.5,31 59.5,33
  pour Top (no thermals): 59.5,33 62,33 62,31 59.5,31
N$43  (via drill 0.35)
  other vias: 60.5,20.5 77.5,20.5 60.5,19.5 77.5,19.5 76.5,19.5 76.5,20.5 61.5,19.5 61.5,20.5
  pour Top (no thermals): 78.5,19 78.5,21 76,21 76,19
  pour Top (no thermals): 62,19 62,21 59.5,21 59.5,19
  pour Bottom (no thermals): 78.5,19 78.5,21 59.5,21 59.5,19
N$44  (via drill 0.35)
  other vias: 80.5,20.5 97.5,20.5 96.5,20.5 96.5,19.5 97.5,19.5 81.5,20.5 81.5,19.5 80.5,19.5
  pour Top (no thermals): 98.5,19 98.5,21 96,21 96,19
  pour Bottom (no thermals): 98.5,19 98.5,21 79.5,21 79.5,19
  pour Top (no thermals): 79.5,21 79.5,19 82,19 82,21
N$45  (via drill 0.35)
  other vias: 100.5,20.5 117.5,20.5 116.5,20.5 116.5,19.5 117.5,19.5 100.5,19.5 101.5,19.5 101.5,20.5
  pour Top (no thermals): 118.5,19 118.5,21 116,21 116,19
  pour Bottom (no thermals): 118.5,19 118.5,21 99.5,21 99.5,19
  pour Top (no thermals): 99.5,21 102,21 102,19 99.5,19
N$46  (via drill 0.35)
  other vias: 120.5,19.5 137.5,20.5 137.5,19.5 136.5,19.5 136.5,20.5 120.5,20.5 121.5,19.5 121.5,20.5
  pour Top (no thermals): 138.5,19 138.5,21 136,21 136,19
  pour Bottom (no thermals): 138.5,21 138.5,19 119.5,19 119.5,21
  pour Top (no thermals): 119.5,21 119.5,19 122,19 122,21
N$48  (via drill 0.35)
  other vias: 75.5,49.5 92.5,50.5 75.5,50.5 76.5,50.5 76.5,49.5 92.5,49.5 91.5,49.5 91.5,50.5
  pour Top (no thermals): 91,51 93.5,51 93.5,49 91,49
  pour Bottom (no thermals): 74.5,49 74.5,51 77,51 79.5,53.5 88.5,53.52 88.5,53.5 91,51 93.5,51 93.5,49 91,49 91,49.5 88,52.5 80,52.5 77,49.5 77,49
  pour Top (no thermals): 74.5,51 77,51 77,49 74.5,49
N$49  (via drill 0.35)
  other vias: 95.5,50.5 112.5,49.5 95.5,49.5 96.5,49.5 96.5,50.5 112.5,50.5 111.5,50.5 111.5,49.5
  pour Top (no thermals): 111,51 113.5,51 113.5,49 111,49
  pour Bottom (no thermals): 94.5,49 94.5,51 97,51 99.5,53.5 108.5,53.52 108.5,53.5 111,51 113.5,51 113.5,49 111,49 111,49.5 108,52.5 100,52.5 97,49.5 97,49
  pour Top (no thermals): 94.5,51 97,51 97,49 94.5,49
N$50  (via drill 0.35)
  other vias: 115.5,50.5 132.5,50.5 115.5,49.5 116.5,49.5 116.5,50.5 132.5,49.5 131.5,49.5 131.5,50.5
  pour Bottom (no thermals): 114.5,49 114.5,51 117,51 119.5,53.5 128.5,53.52 128.5,53.5 131,51 133.5,51 133.5,49 131,49 131,49.5 128,52.5 120,52.5 117,49.5 117,49
  pour Top (no thermals): 131,51 133.5,51 133.5,49 131,49
  pour Top (no thermals): 114.5,51 117,51 117,49 114.5,49
N$52
  Top 0.5: U1.2 24.96,59.56 C10.1
N$53
  Top 0.55: U1.7 16.73,59.56 16.6,59.7 C9.1
N$56  (via drill 0.35)
  Top 1: v136.5,38.5 136.5,40 134.5,42 134.5,45.5 136.5,47.5 v136.5,49.5
  other vias: 135.5,50.5 135.5,37.5 135.5,38.5 136.5,37.5 135.5,49.5 136.5,50.5
  pour Bottom (no thermals): 134.5,39 137.5,39 137.5,37 134.5,37
  pour Top (no thermals): 134.5,39 137,39 137,37 134.5,37
  pour Top (no thermals): 134.5,51 137,51 137,49 134.5,49
  pour Bottom (no thermals): 134.5,51 137.5,51 137.5,49 134.5,49
N$57  (via drill 0.35)
  Bottom 1: v51.5,37.5 v51.5,26.5
  other vias: 52.5,26.5 52.5,25.5 51.5,25.5 52.5,38.5 52.5,37.5 51.5,38.5
  pour Top (no thermals): 51,27 53.5,27 53.5,25 51,25
  pour Top (no thermals): 51,39 53.5,39 53.5,37 51,37
  pour Bottom (no thermals): 53.5,37 53.5,39 50.5,39 50.5,37
  pour Bottom (no thermals): 53.5,25 53.5,27 50.5,27 50.5,25
N$77  (via drill 0.35)
  Top 1: v141.5,32.5 141.5,34.5 139.5,36.5 139.5,39.5 141.5,41.5 v141.5,43.5
  other vias: 140.5,44.5 140.5,43.5 140.5,31.5 140.5,32.5 141.5,31.5 141.5,44.5
  pour Bottom (no thermals): 139.5,33 142.5,33 142.5,31 139.5,31
  pour Top (no thermals): 139.5,33 142,33 142,31 139.5,31
  pour Top (no thermals): 139.5,45 142,45 142,43 139.5,43
  pour Bottom (no thermals): 139.5,45 142.5,45 142.5,43 139.5,43
N$88  (via drill 0.35)
  Top 1: v61.5,37.5 61.5,36 63.5,34 63.5,30 61.5,28 v61.5,26.5
  other vias: 62.5,38.5 62.5,37.5 62.5,26.5 62.5,25.5 61.5,25.5 61.5,38.5
  pour Top (no thermals): 61,27 63.5,27 63.5,25 61,25
  pour Top (no thermals): 61,39 63.5,39 63.5,37 61,37
  pour Bottom (no thermals): 63.5,25 63.5,27 60,27 60,25
  pour Bottom (no thermals): 63.5,37 63.5,39 60,39 60,37
RED-OUT  (via drill 0.35)
  Top 1: L2.P$2 41.82,42.32 v42.9,43.4 43,43.5 | C4.1 43,43.5 | 43,43.5 v43.4,43.9 v43.9,44.4
  Bottom 1: v61.5,49.5 58.9,46.9 51.3,46.9 48.8,44.4 v43.9,44.4 v43.4,43.9 v42.9,43.4
  other vias: 62.5,49.5 62.5,50.5 61.5,50.5
  pour Top (no thermals): 61,51 63.5,51 63.5,49 61,49
  pour Bottom (no thermals): 63.5,49 63.5,51 60,51 60,49
RED-RTN  (via drill 0.35)
  Top 0.3: U2.5 17.94,49.64 19.6,51.3 24,51.3 24.9,50.4 R2.2
  Top 1: R2.2 C4.2 44.7,48.9 48.6,45 48.6,18.2 51.8,15 v57,15 v58,15 v59,15
  Bottom 1: v57,15 141.5,15 146.5,20 v146.5,25.5
  other vias: 145.5,26.5 145.5,25.5 146.5,26.5
  pour Bottom (no thermals): 144.5,27 147.5,27 147.5,25 144.5,25
  pour Top (no thermals): 144.5,27 147,27 147,25 144.5,25
VPP
  Top 0.3: R4.2 11.12,26.84 11.2,26.76 | R1.2 11.49,41.86 | R5.2 11.55,58.35 11.5,58.3 | C8.1 12.7,57.95 12.7,58.3
  Top 0.55: U3.8 16.36,26.8 16.33,26.76 | C6.1 12.7,26.46 13,26.76 | 16.3,42.3 U2.8 | 11.49,41.86 11.5,41.85 | U1.8 16.61,58.3 16.6,58.3
  Top 1: 16.33,26.76 13,26.76 11.2,26.76 9.04,26.76 7.9,27.9 7.9,39.2 | 7.9,41.85 11.5,41.85 C1.1 14.05,41.85 14.5,42.3 16.3,42.3 | 7.9,41.85 7.9,56.8 9.4,58.3 11.5,58.3 12.7,58.3 16.6,58.3 | 7.9,41.85 7.9,39.3 7.9,39.2 | 7.9,39.2 4.21,39.2 X1.1

### Text on the board
tPlace: Solar Simulator v1.0 | B Driver | 2019/03/25 | R Driver | G Driver
dxf: OVERHANG | ALUMINUM | CON | LEDS | ARDUINO NANO | SOLAR SIMULATOR V1.0
tDocu: B | R | B | R | B | R | B | R | B | R | G | G | G | G | G | B | R | B | R | B | R | B | R | B | R | G | G | G | G | G | B | R | B | R | B | R | B | R | B | R | G | G | G | G | G